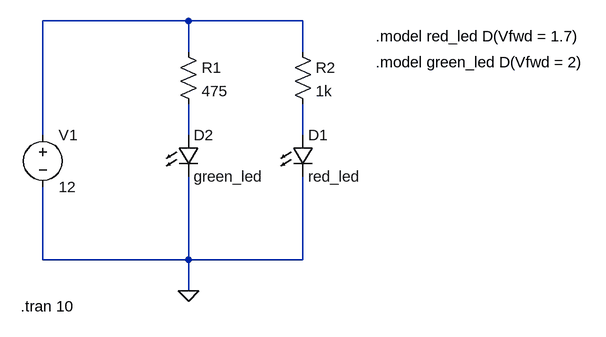
[diagram p0: schematic led_diode.asc]
led_diode.asc, the LTspice schematic file:
Version 4
SHEET 1 880 680
WIRE 112 -80 -112 -80
WIRE 288 -80 112 -80
WIRE 112 -32 112 -80
WIRE 288 -32 288 -80
WIRE -112 96 -112 -80
WIRE 112 96 112 48
WIRE 288 96 288 48
WIRE -112 288 -112 176
WIRE 112 288 112 160
WIRE 112 288 -112 288
WIRE 288 288 288 160
WIRE 288 288 112 288
WIRE 112 336 112 288
FLAG 112 336 0
SYMBOL LED 272 96 R0
SYMATTR InstName D1
SYMATTR Value red_led
SYMATTR Description Diode
SYMATTR Type diode
SYMBOL LED 96 96 R0
SYMATTR InstName D2
SYMATTR Value green_led
SYMATTR Description Diode
SYMATTR Type diode
SYMBOL voltage -112 80 R0
WINDOW 123 0 0 Left 0
WINDOW 39 0 0 Left 0
SYMATTR InstName V1
SYMATTR Value 12
SYMBOL res 96 -48 R0
SYMATTR InstName R1
SYMATTR Value 475
SYMBOL res 272 -48 R0
SYMATTR InstName R2
SYMATTR Value 1k
TEXT 400 -56 Left 2 !.model red_led D(Vfwd = 1.7)
TEXT 400 -16 Left 2 !.model green_led D(Vfwd = 2)
TEXT -146 360 Left 2 !.tran 10

The netlist it stands for:
* led_diode.asc
D1 N003 0 red_led
D2 N002 0 green_led
V1 N001 0 12
R1 N001 N002 475
R2 N001 N003 1k
.model D D
.lib standard.dio
.model red_led D(Vfwd = 1.7)
.model green_led D(Vfwd = 2)
.tran 10
.backanno
.end